# EAGLE schematic PTSymmetryControllerSchematic (EAGLE 9.5.1)
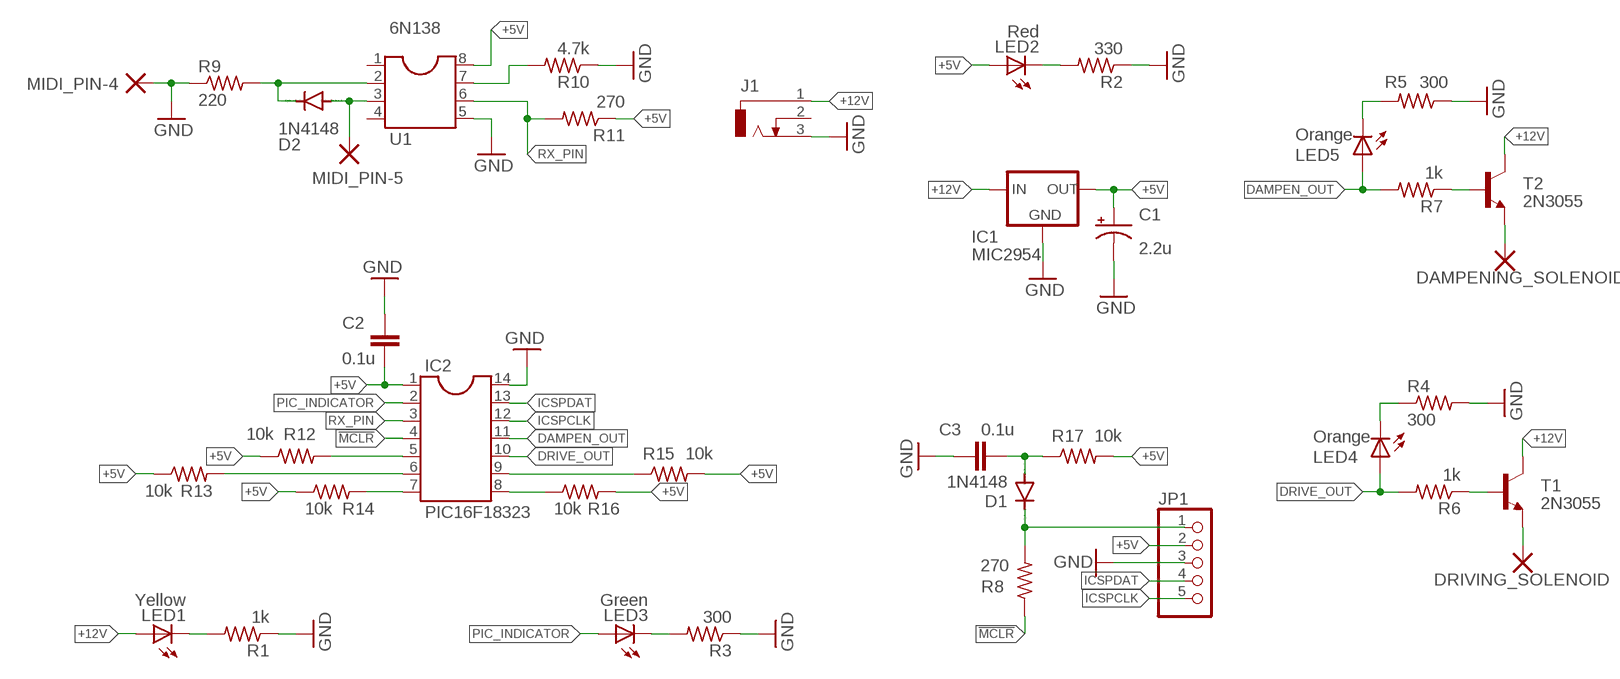
[diagram p0: schematic, sheet 1]

## Parts
6N138  U1  DIL8S  [SOCKET-08]
C1  2.2u  CPOL-USE2.5-6  [E2,5-6]
C2  0.1u  C5/2.5  [C5B2.5]
C3  0.1u  C5/2.5  [C5B2.5]
D1  1N4148  1N4148DO35-10  [DO35-10]
D2  1N4148  1N4148DO35-10  [DO35-10]
DAMPENING_SOLENOID  DOUBLE_THROUGH_HOLE_PAD  [DOUBLE_THROUGH_HOLE_PAD]
DRIVING_SOLENOID  DOUBLE_THROUGH_HOLE_PAD  [DOUBLE_THROUGH_HOLE_PAD]
IC1  MIC2954  78XXL  [78XXL]
IC2  PIC16F18323  DIL14S  [SOCKET-14]
J1  DCJ0303  [DCJ0303]
JP1  1x5x2mm-pinheader  PINHD-1X5  [1X05]
LED1  Yellow  LED5MM  [LED5MM]
LED2  Red  LED5MM  [LED5MM]
LED3  Green  LED5MM  [LED5MM]
LED4  Orange  LED5MM  [LED5MM]
LED5  Orange  LED5MM  [LED5MM]
MIDI_PIN-4  DOUBLE_THROUGH_HOLE_PAD  [DOUBLE_THROUGH_HOLE_PAD]
MIDI_PIN-5  DOUBLE_THROUGH_HOLE_PAD  [DOUBLE_THROUGH_HOLE_PAD]
R1  1k  R-US_0207/10  [0207/10]
R2  330  R-US_0207/10  [0207/10]
R3  300  R-US_0207/10  [0207/10]
R4  300  R-US_0207/10  [0207/10]
R5  300  R-US_0207/10  [0207/10]
R6  1k  R-US_0207/10  [0207/10]
R7  1k  R-US_0207/10  [0207/10]
R8  270  R-US_0207/10  [0207/10]
R9  220  R-US_0207/12  [0207/12]
R10  4.7k  R-US_0207/12  [0207/12]
R11  270  R-US_0207/12  [0207/12]
R12  10k  R-US_0207/10  [0207/10]
R13  10k  R-US_0207/10  [0207/10]
R14  10k  R-US_0207/10  [0207/10]
R15  10k  R-US_0207/10  [0207/10]
R16  10k  R-US_0207/10  [0207/10]
R17  10k  R-US_0207/10  [0207/10]
T1  2N3055  [TO3]
T2  2N3055  [TO3]

## Nets
!MCLR: IC2.4 R8.1
+5V: 6N138.8 C1.+ C2.2 IC1.OUT IC2.1 JP1.2 LED2.A R11.1 R12.1 R13.1 R14.1 R15.2 R16.2 R17.2
+12V: IC1.IN J1.1 LED1.A T1.C T1.C/(C) T2.C T2.C/(C)
DAMPEN_OUT: IC2.11 LED5.A R7.2
DRIVE_OUT: IC2.10 LED4.A R6.2
GND: 6N138.5 C1.- C2.1 C3.1 IC1.GND IC2.14 J1.3 JP1.3 MIDI_PIN-4.P$1 R1.1 R2.1 R3.1 R4.2 R5.1 R9.1 R10.1
ICSPCLK: IC2.12 JP1.5
ICSPDAT: IC2.13 JP1.4
MIDI_PIN-5: 6N138.3 D2.A MIDI_PIN-5.P$1
N$1: LED1.K(C) R1.2
N$2: LED2.K(C) R2.2
N$3: 6N138.7 R10.2
N$4: LED5.K(C) R5.2
N$5: LED4.K(C) R4.1
N$6: C3.2 D1.A R17.1
N$7: D1.C JP1.1 R8.2
N$8: LED3.K(C) R3.2
N$9: 6N138.2 D2.C R9.2
N$10: IC2.5 R12.2
N$11: IC2.6 R13.2
N$12: IC2.7 R14.2
N$13: DRIVING_SOLENOID.P$1 T1.E
N$14: IC2.9 R15.1
N$15: R6.1 T1.B
N$16: R7.1 T2.B
N$17: IC2.8 R16.1
N$18: DAMPENING_SOLENOID.P$1 T2.E
PIC_INDICATOR: IC2.2 LED3.A
RX_PIN: 6N138.6 IC2.3 R11.2
Unconnected: 6N138.1 6N138.4 J1.2

## Library data of the parts
6N138 = ic-package:DIL8: Dual In Line / Socket
C1 = rcl:CPOL-US: POLARIZED CAPACITOR, American symbol; SPICEPREFIX: C
C2 C3 = capacitor-wima:C: CAPACITOR naming: grid - package width
D1 D2 = diode:1N4148: DIODE high speed (Philips)
DAMPENING_SOLENOID DRIVING_SOLENOID MIDI_PIN-4 MIDI_PIN-5 = Double-Through-Hole-Pad:DOUBLE_THROUGH_HOLE_PAD
IC1 = v-reg:78XXL: VOLTAGE REGULATOR
IC2 = ic-package:DIL14: Dual In Line / Socket
J1 = con-jack:DCJ0303: DC POWER JACK Source: DCJ0303.pdf; OC_FARNELL: unknown; OC_NEWARK: unknown
JP1 = pinhead:PINHD-1X5: PIN HEADER
LED1-LED5 = led:LED: LED OSRAM: - CHIPLED LG R971, LG N971, LY N971, LG Q971, LY Q971, LO R971, LY R971 LH N974, LH R974 LS Q976, LO Q976, LY Q976 LO Q996 - Hyper CHIPLED LW Q18S LB Q993, LB Q99A, LB R99A - SideLED LS A670, LO A670, LY A670, LG A670, LP A670 LB A673, LV A673, LT A673, LW A673 LH A674 LY A675 LS A676, LA A676, LO A676, LY A676, LW A676 LS A679, LY A679, LG A679 - Hyper Micro SIDELED® LS Y876, LA Y876, LO Y876, LY Y876 LT Y87S - SmartLED LW L88C, LW L88S LB L89C, LB L89S, LG L890 LS L89K, LO L89K, LY L89K LS L896, LA L896, LO L896, LY L896 - TOPLED LS T670, LO T670, LY T670, LG T670, LP T670 LSG T670, LSP T670, LSY T670, LOP T670, LYG T670 LG T671, LOG T671, LSG T671 LB T673, LV T673, LT T673, LW T673 LH T674 LS T676, LA T676, LO T676, LY T676, LB T676, LH T676, LSB T676, LW T676 LB T67C, LV T67C, LT T67C, LS T67K, LO T67K, LY T67K, LW E67C LS E67B, LA E67B, LO E67B, LY E67B, LB E67C, LV E67C, LT E67C LW T67C LS T679, LY T679, LG T679 LS T770, LO T770, LY T770, LG T770, LP T770 LB T773, LV T773, LT T773, LW T773 LH T774 LS E675, LA E675, LY E675, LS T675 LS T776, LA T776, LO T776, LY T776, LB T776 LHGB T686 LT T68C, LB T68C - Hyper Mini TOPLED® LB M676 - Mini TOPLED Santana® LG M470 LS M47K, LO M47K, LY M47K Source: http://www.osram.convergy.de LUXEON: - LUMILED® LXK2-PW12-R00, LXK2-PW12-S00, LXK2-PW14-U00, LXK2-PW14-V00 LXK2-PM12-R00, LXK2-PM12-S00, LXK2-PM14-U00 LXK2-PE12-Q00, LXK2-PE12-R00, LXK2-PE12-S00, LXK2-PE14-T00, LXK2-PE14-U00 LXK2-PB12-K00, LXK2-PB12-L00, LXK2-PB12-M00, LXK2-PB14-N00, LXK2-PB14-P00, LXK2-PB14-Q00 LXK2-PR12-L00, LXK2-PR12-M00, LXK2-PR14-Q00, LXK2-PR14-R00 LXK2-PD12-Q00, LXK2-PD12-R00, LXK2-PD12-S00 LXK2-PH12-R00, LXK2-PH12-S00 LXK2-PL12-P00, LXK2-PL12-Q00, LXK2-PL12-R00 Source: www.luxeon.com KINGBRIGHT: KA-3528ASYC Source: www.kingbright.com
R1-R8 R12-R17 = rcl:R-US_: RESISTOR, American symbol; SPICEPREFIX: R
R9-R11 = resistor:R-US_: RESISTOR, American symbol
T1 T2 = transistor:2N3055: NPN TRANSISTOR

## Net classes
0 default: width 1.27 mm, drill 1.27 mm, clearance 0.508 mm
2 signal: width 0.15 mm, drill 0.406 mm, clearance 0.127 mm
3 ground: width 0.15 mm, drill 0.406 mm, clearance 0.127 mm
4 3.3V: width 0.15 mm, drill 0.406 mm, clearance 0.127 mm